# Altium schematic sheet OA.SchDoc
size A4
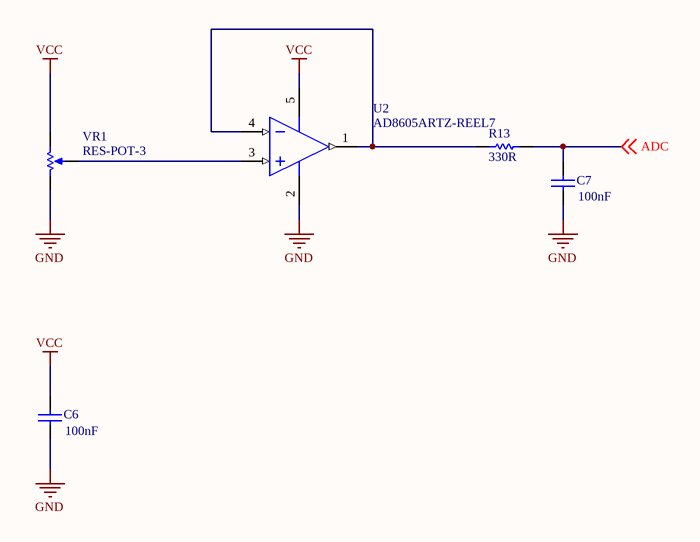
[diagram p0: OA.SchDoc]

## Parts
C6  100nF  [CAPC0805(2012)75_M]
C7  100nF  [CAPC0805(2012)75_M]
R13  330R  [RESC0805(2012)_M]
U2  AD8605ARTZ-REEL7  [ADI-RJ-5_M]
VR1  RES-POT-3  [RES-POT-3]

## Nets
GND: C6.1 C7.1 U2.2(-V) VR1.3(CW)
VCC: C6.2 U2.5(+V) VR1.1(CCW)
ADC: C7.2 R13.2 ; off-sheet ADC
NetR13_1: R13.1 U2.1(OUT) U2.4(-IN)
NetU2_3: U2.3(+IN) VR1.2(S)

## Library data of the parts
C6 C7 = CMP-1036-04403-1: CAP 100nF 16V ±20% 0805 (2012 Metric) Thickness 0.75mm SMD; Case-EIA: 0805; Tolerance: Â±20%; Case-Metric: 2012; Rated Voltage: 16 V; Value: 100nF; Technology: SMT; Max Thickness: 0.75 mm
R13 = CMP-1013-00062-1: 330R 0.125W 5% 0805 (2012 Metric)  SMD; Value: 330.00 Ohm; Case-EIA: 0805; Case-Metric: 2012; Tolerance: 5 %; Power: 0.125 W; Technology: SMT
U2 = CMP-0384-01494-2: Single Channel Wide Bandwidth Operational Amplifier, 10 MHz BW, 5 V/us SR, Industrial, 5-pin SOT23 (RJ-5), Reel; Manufacturer: Analog Devices; Generic Part Number: AD8605; Input Offset Voltage: 20uV; V Span Min: 2.7V; Input Bias Current: 200fA; Slew Rate: 5V/us; V Span Max: 6V; Small Signal Bandwidth: 10MHz; Amplifiers Per Package: 1; Iq/Amp: 1.2mA; ComponentLink2Description: Datasheet; PackageVersion: 121608-A; Mounting Technology: Surface Mount; ComponentLink3URL: http://www.analog.com/static/imported-files/packages/PKG_PDF/SOT-23(RJ)/RJ_5.pdf; Code_JEDEC: MO-178-AA; ComponentLink1Description: Manufacturer URL; ComponentLink4Description: Reference Circuit; RevisionNote: Reference Circuit URL fixed; PartNumber: AD8605ARTZ-REEL7; DatasheetVersion: Rev. L; PackageDescription: 5-Pin Small Outline Transistor Package, Body 2.9 x 1.6 mm, Pitch 0.95 mm; ComponentLink4URL: http://www.analog.com/en/all-operational-amplifiers-op-amps/operational-amplifiers-op-amps/ad8605/products/product.html#product-recommendations; ComponentLink3Description: Package Specification; ComponentLink1URL: http://www.analog.com/en/index.html; PackageReference: RJ-5; ComponentLink2URL: http://www.analog.com/static/imported-files/data_sheets/AD8605_8606_8608.pdf
VR1 = RES-POT-3: Potentiometer: 10K